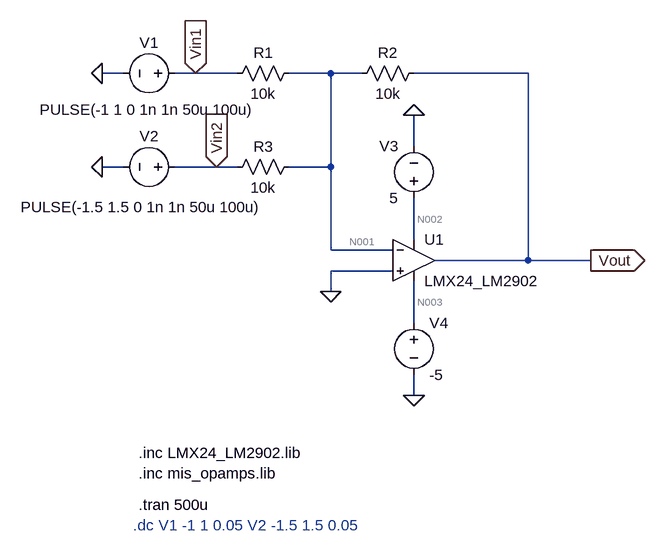
[diagram p0: schematic LM324.asc]
LM324.asc, the LTspice schematic file:
Version 4.1
SHEET 1 880 680
WIRE -48 -160 -80 -160
WIRE 64 -160 32 -160
WIRE 128 -160 64 -160
WIRE 272 -160 208 -160
WIRE 320 -160 272 -160
WIRE 576 -160 400 -160
WIRE 400 -48 400 -96
WIRE -48 -16 -80 -16
WIRE 96 -16 32 -16
WIRE 128 -16 96 -16
WIRE 272 -16 272 -160
WIRE 272 -16 208 -16
WIRE 400 96 400 32
WIRE 272 112 272 -16
WIRE 368 112 272 112
WIRE 576 128 576 -160
WIRE 576 128 432 128
WIRE 672 128 576 128
WIRE 368 144 272 144
WIRE 272 176 272 144
WIRE 400 224 400 160
WIRE 400 336 400 304
FLAG 400 -96 0
FLAG 400 336 0
FLAG 272 176 0
FLAG 672 128 Vout
IOPIN 672 128 Out
FLAG -80 -160 0
FLAG -80 -16 0
FLAG 64 -160 Vin1
IOPIN 64 -160 In
FLAG 96 -16 Vin2
IOPIN 96 -16 In
SYMBOL res 224 -176 R90
WINDOW 0 0 56 VBottom 2
WINDOW 3 32 56 VTop 2
SYMATTR InstName R1
SYMATTR Value 10k
SYMBOL res 416 -176 R90
WINDOW 0 0 56 VBottom 2
WINDOW 3 32 56 VTop 2
SYMATTR InstName R2
SYMATTR Value 10k
SYMBOL OpAmps\\opamp2 400 64 R0
SYMATTR InstName U1
SYMATTR Value LMX24_LM2902
SYMBOL voltage 400 48 R180
WINDOW 0 24 96 Left 2
WINDOW 3 24 16 Left 2
SYMATTR InstName V3
SYMATTR Value 5
SYMBOL voltage 400 208 R0
WINDOW 123 0 0 Left 0
WINDOW 39 0 0 Left 0
SYMATTR InstName V4
SYMATTR Value -5
SYMBOL voltage 48 -160 R90
WINDOW 0 -32 56 VBottom 2
WINDOW 3 40 58 VTop 2
WINDOW 123 0 0 Left 0
WINDOW 39 0 0 Left 0
SYMATTR InstName V1
SYMATTR Value PULSE(-1 1 0 1n 1n 50u 100u)
SYMBOL res 224 -32 R90
WINDOW 0 0 56 VBottom 2
WINDOW 3 32 56 VTop 2
SYMATTR InstName R3
SYMATTR Value 10k
SYMBOL voltage 48 -16 R90
WINDOW 0 -32 56 VBottom 2
WINDOW 3 46 67 VTop 2
WINDOW 123 0 0 Left 0
WINDOW 39 0 0 Left 0
SYMATTR InstName V2
SYMATTR Value PULSE(-1.5 1.5 0 1n 1n 50u 100u)
TEXT -24 456 Left 2 !.inc mis_opamps.lib
TEXT -32 536 Left 2 ;.dc V1 -1 1 0.05 V2 -1.5 1.5 0.05
TEXT -24 424 Left 2 !.inc LMX24_LM2902.lib
TEXT -24 504 Left 2 !.tran 500u

The netlist it stands for:
* LM324.asc
R1 N001 Vin1 10k
R2 Vout N001 10k
X§U1 0 N001 N002 N003 Vout LMX24_LM2902  ; pins In+ In- V+ V- OUT
V3 N002 0 5
V4 N003 0 -5
V1 Vin1 0 PULSE(-1 1 0 1n 1n 50u 100u)
R3 N001 Vin2 10k
V2 Vin2 0 PULSE(-1.5 1.5 0 1n 1n 50u 100u)
.inc mis_opamps.lib
* .dc V1 -1 1 0.05 V2 -1.5 1.5 0.05
.inc LMX24_LM2902.lib
.tran 500u
.backanno
.end

* Results of the author's LTspice run, read from the files saved beside the schematic
* Operating Point, zero values left out:
*   V(n001) = 1.974 mV
*   V(n002) = 5 V
*   V(n003) = -5 V
*   V(vin1) = -1 V
*   V(vin2) = -1.5 V
*   V(vout) = 2.506 V
*   I(R1) = 100.2 µA
*   I(R2) = 250.4 µA
*   I(R3) = 150.2 µA
*   I(V1) = 100.2 µA
*   I(V2) = 150.2 µA
*   I(V3) = -213.4 µA
*   I(V4) = -37.04 µA
*   Ix(u1:1) = -51.91 nA
*   Ix(u1:2) = -38.01 nA
*   Ix(u1:28) = -250.4 µA
*   Ix(u1:50) = 37.04 µA
*   Ix(u1:99) = 213.4 µA
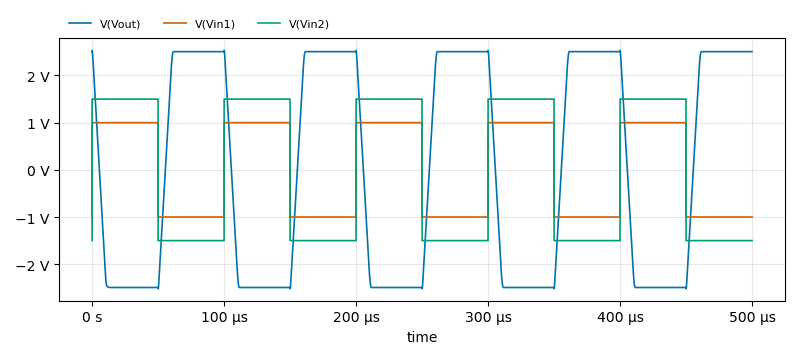
[diagram p1: Transient Analysis of LM324.asc, plotted from the saved traces]
* Transient Analysis, 1 run:
*   V(Vout): min -2.522 V, max 2.533 V, average 5.546 mV, rms 2.32 V, last 2.506 V
*   V(Vin1): min -1 V, max 1 V, average 20 µV, rms 1 V, last -1 V
*   V(Vin2): min -1.5 V, max 1.5 V, average 30 µV, rms 1.5 V, last -1.5 V